# EAGLE schematic FNR v1.3 + Speed v1.2 (EAGLE 6.3)
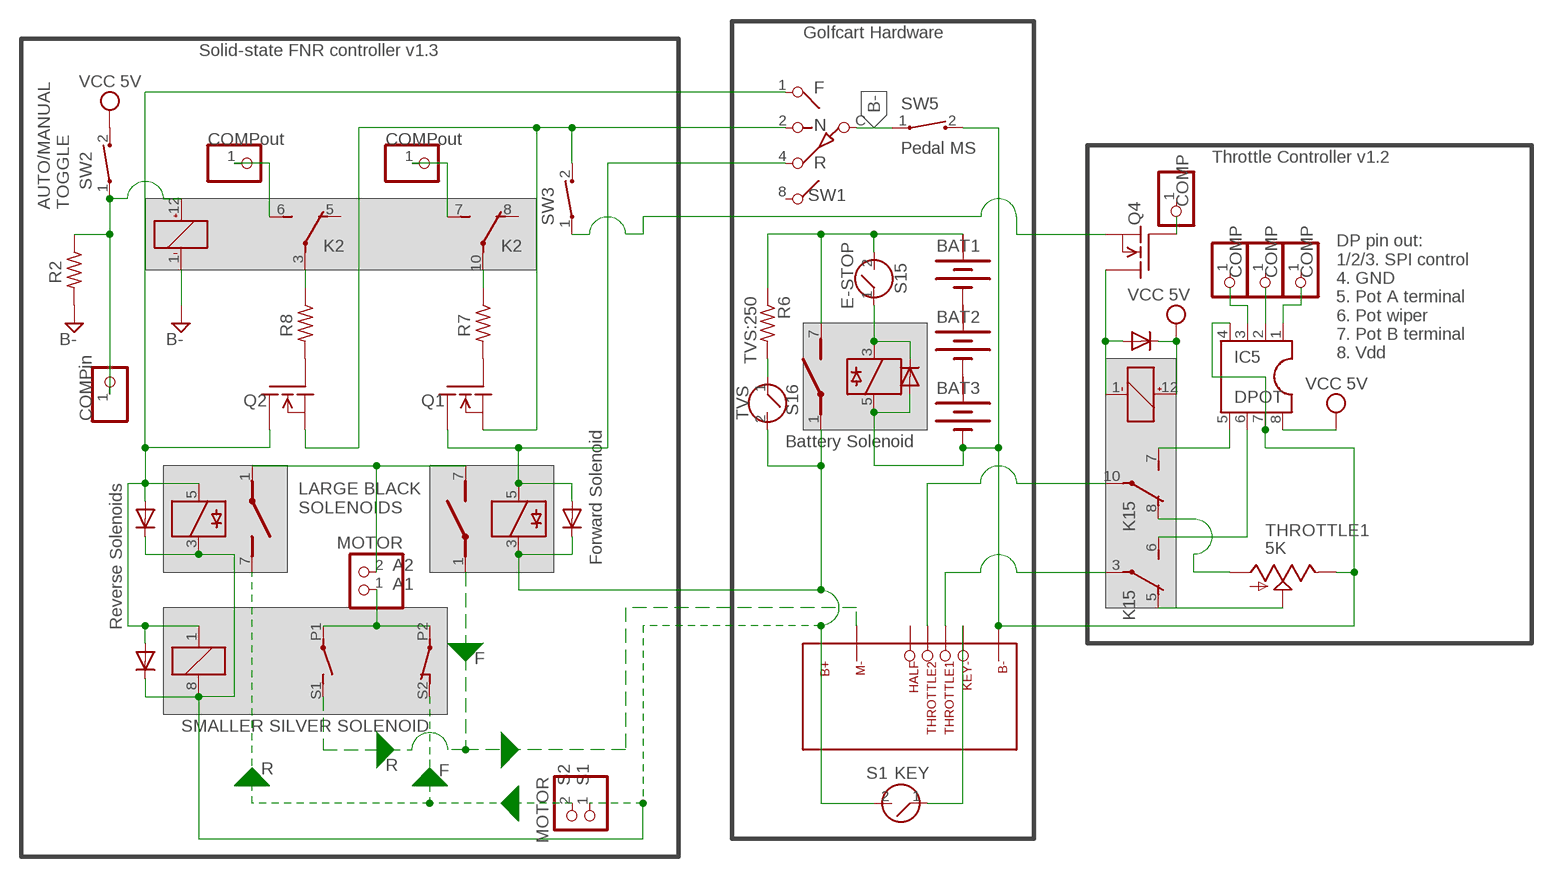
[diagram p0: schematic, sheet 1]

## Parts
BAT1  BATTERY  [BATTERY]
BAT2  BATTERY  [BATTERY]
BAT3  BATTERY  [BATTERY]
D1  1N4004  [DO41-10]
D2  1N4004  [DO41-10]
D3  1N4004  [DO41-10]
D10  1N4004  [DO41-10]
D11  1N4004  [DO41-10]
IC5  DPOT  DIL8  [DIL08]
JP1  MOTOR  PINHD-1X2  [1X02]
JP2  MOTOR  PINHD-1X2  [1X02]
JP4  COMPout  PINHD-1X1  [1X01]
JP6  COMPin  PINHD-1X1  [1X01]
JP22  COMPout  PINHD-1X1  [1X01]
JP25  COMP  PINHD-1X1  [1X01]
JP26  COMP  PINHD-1X1  [1X01]
JP27  COMP  PINHD-1X1  [1X01]
JP28  COMP  PINHD-1X1  [1X01]
K1  35701331  [REED]
K2  DF2-L-DC24V  [DF2]
K3  35701331  [REED]
K4  G6C-2117P  [G6C-2117P]
K15  DF2-L-DC24V  [DF2]
K16  35701331  [REED]
Q1  BUZ11  [TO220]
Q2  BUZ11  [TO220]
Q4  BUZ11  [TO220]
R2  R-US_0204/5  [0204/5]
R6  TVS:250  R-US_0204/5  [0204/5]
R7  R-US_0204/5  [0204/5]
R8  R-US_0204/5  [0204/5]
S1  KEY  SWITCH  [SWITCH]
S15  E-STOP  SWITCH  [SWITCH]
S16  TVS  SWITCH  [SWITCH]
SW1  SW-C10  [SW-C10]
SW2  Pedal MS  CT10-XXXX-A2  [CT10-XXXX-A2]
SW3  Pedal MS  CT10-XXXX-A2  [CT10-XXXX-A2]
SW5  Pedal MS  CT10-XXXX-A2  [CT10-XXXX-A2]
THROTTLE1  5K  TRIM_US-CT6  [CT6]
U$4  MOTOR-CONTROLLER  [MOTOR-CONTROLLER]

## Nets
A1: JP1.1 K4.P1(2:P) K4.P2(3:P)
A2: JP1.2 K1.1(2:P) K3.7(2:S)
B+: D1.C D2.C D3.C JP2.1 JP2.2 K1.3 K1.7(2:S) K3.3 K4.8 K4.S2(3:O) K16.1(2:P) S1.2 S16.2 U$4.P$2(B+)
B-: BAT3.- D11.A IC5.4 IC5.7 K16.5 Q1.3(S) Q2.3(S) SW1.2 SW3.2 SW5.2 THROTTLE1.E U$4.P$1(B-)
FGND: D3.A K3.5 Q1.2(D) SW1.4
GND1: K2.1(1:-) R2.2 ; supply symbol labelled B-
M-: K3.1(2:P) K4.S1(2:S) U$4.P$3(M-)
N$1: JP4.1 K2.6(2:S)
N$2: JP22.1 K2.7(3:S)
N$4: Q4.3(S) SW3.1
N$6: BAT1.- BAT2.+
N$7: BAT2.- BAT3.+
N$8: K15.3(2:P) K15.10(3:P) U$4.P$5(THROTTLE1) U$4.P$6(THROTTLE2)
N$9: S1.1 U$4.P$4(KEY-)
N$10: K2.10(3:P) R7.1
N$11: Q2.1(G) R8.2
N$12: Q1.1(G) R7.2
N$13: K2.3(2:P) R8.1
N$23: JP6.1 K2.12(1:+) R2.1 SW2.1
N$54: IC5.2
N$88: BAT1.+ K16.7(2:S) R6.1 S15.2
N$89: R6.2 S16.1
N$91: K15.5(2:O) THROTTLE1.S
N$92: IC5.6 K15.6(2:S)
N$93: IC5.5 K15.7(3:S)
N$94: K15.8(3:O) THROTTLE1.A
N$95: IC5.1
N$96: IC5.3
N$97: SW1.C SW5.1
N$98: D10.A K15.1(1:-) Q4.2(D)
N$99: Q4.1(G)
N$100: D11.C K16.3 S15.1
RGND: D1.A D2.A K1.5 K4.1 Q2.2(D) SW1.1
VCC: D10.C IC5.8 K15.12(1:+) SW2.2 ; supply symbol labelled VCC 5V
Unconnected: JP25.1 JP26.1 JP27.1 JP28.1 K2.5(2:O) K2.8(3:O) SW1.8 U$4.P$7(HALF)

## Notes on the sheet
- Golfcart Hardware
- Solid-state FNR controller v1.3
- Throttle Controller v1.2
- F
  
  N
  
  R
- AUTO/MANUAL
  TOGGLE
- DP pin out:
  1/2/3. SPI control
  4. GND
  5. Pot A terminal
  6. Pot wiper
  7. Pot B terminal
  8. Vdd
- Forward Solenoid
- Battery Solenoid
- Reverse Solenoids
- LARGE BLACK
  SOLENOIDS
- A2
  A1
- F
- SMALLER SILVER SOLENOID
- S2
  S1
- R | R
- F

## Power pins joined to a net without a drawn wire
+: BAT1.+@1(+) BAT2.+@1(+) BAT3.+@1(+)

## Library data of the parts
BAT1-BAT3 = special:BATTERY: BATTERY
D1-D3 D10 D11 = adafruit:1N4004: DIODE General purpose 1N400x type rectifier (With bigger pads) http://www.ladyada.net/library/pcb/eaglelibrary.html
IC5 = ic-package:DIL8: Dual In Line / Socket
JP1 JP2 = pinhead:PINHD-1X2: PIN HEADER
JP4 JP6 JP22 JP25-JP28 = adafruit:PINHD-1X1: Pin header 1x1 for 0.1" spacing With round pins
K1 K3 K16 = relay:35701331: RELAY reed, 1 x norm. open with polarity; OC_FARNELL: unknown; OC_NEWARK: unknown
K2 K15 = relay:DF2-?DC*: HIGHLY SENSITIVE DIP MINIATURE RELAY NAiS Single side stable / 1 coil latching Source: http://www.mew-europe.com/.. en_ds_61002_0000.pdf; OC_FARNELL: unknown; OC_NEWARK: unknown
K4 = relay:G6C-2117P: RELAY 1 x norm. open, 1x norm. closed, 10 A/240 V, Omron; OC_FARNELL: unknown; OC_NEWARK: unknown
Q1 Q2 Q4 = transistor-fet:BUZ11: N-Channel Enhancement MOSFET 50V; 30A; 0,040Ohm
R2 R6-R8 = rcl:R-US_: RESISTOR, American symbol
S1 S15 S16 = custom:SWITCH: Push button switch
SW1 = special:SW-C10: SWITCH 10-step rotary switch
SW2 SW3 SW5 = switch-coto:CT10-XXXX-: CT10 Series Molded Switch Source: www.cotorelay.com .. Coto_Technology__CT10-1530-G1.pdf
THROTTLE1 = pot:TRIM_US-: POTENTIOMETER
U$4 = custom:MOTOR-CONTROLLER